# EAGLE design Adafruit MPR121Q QT Gator Breakout (EAGLE 9.6.2)
COMPANY: ADAFRUIT INDUSTRIES; DRAWN: KTOWN; REV: A
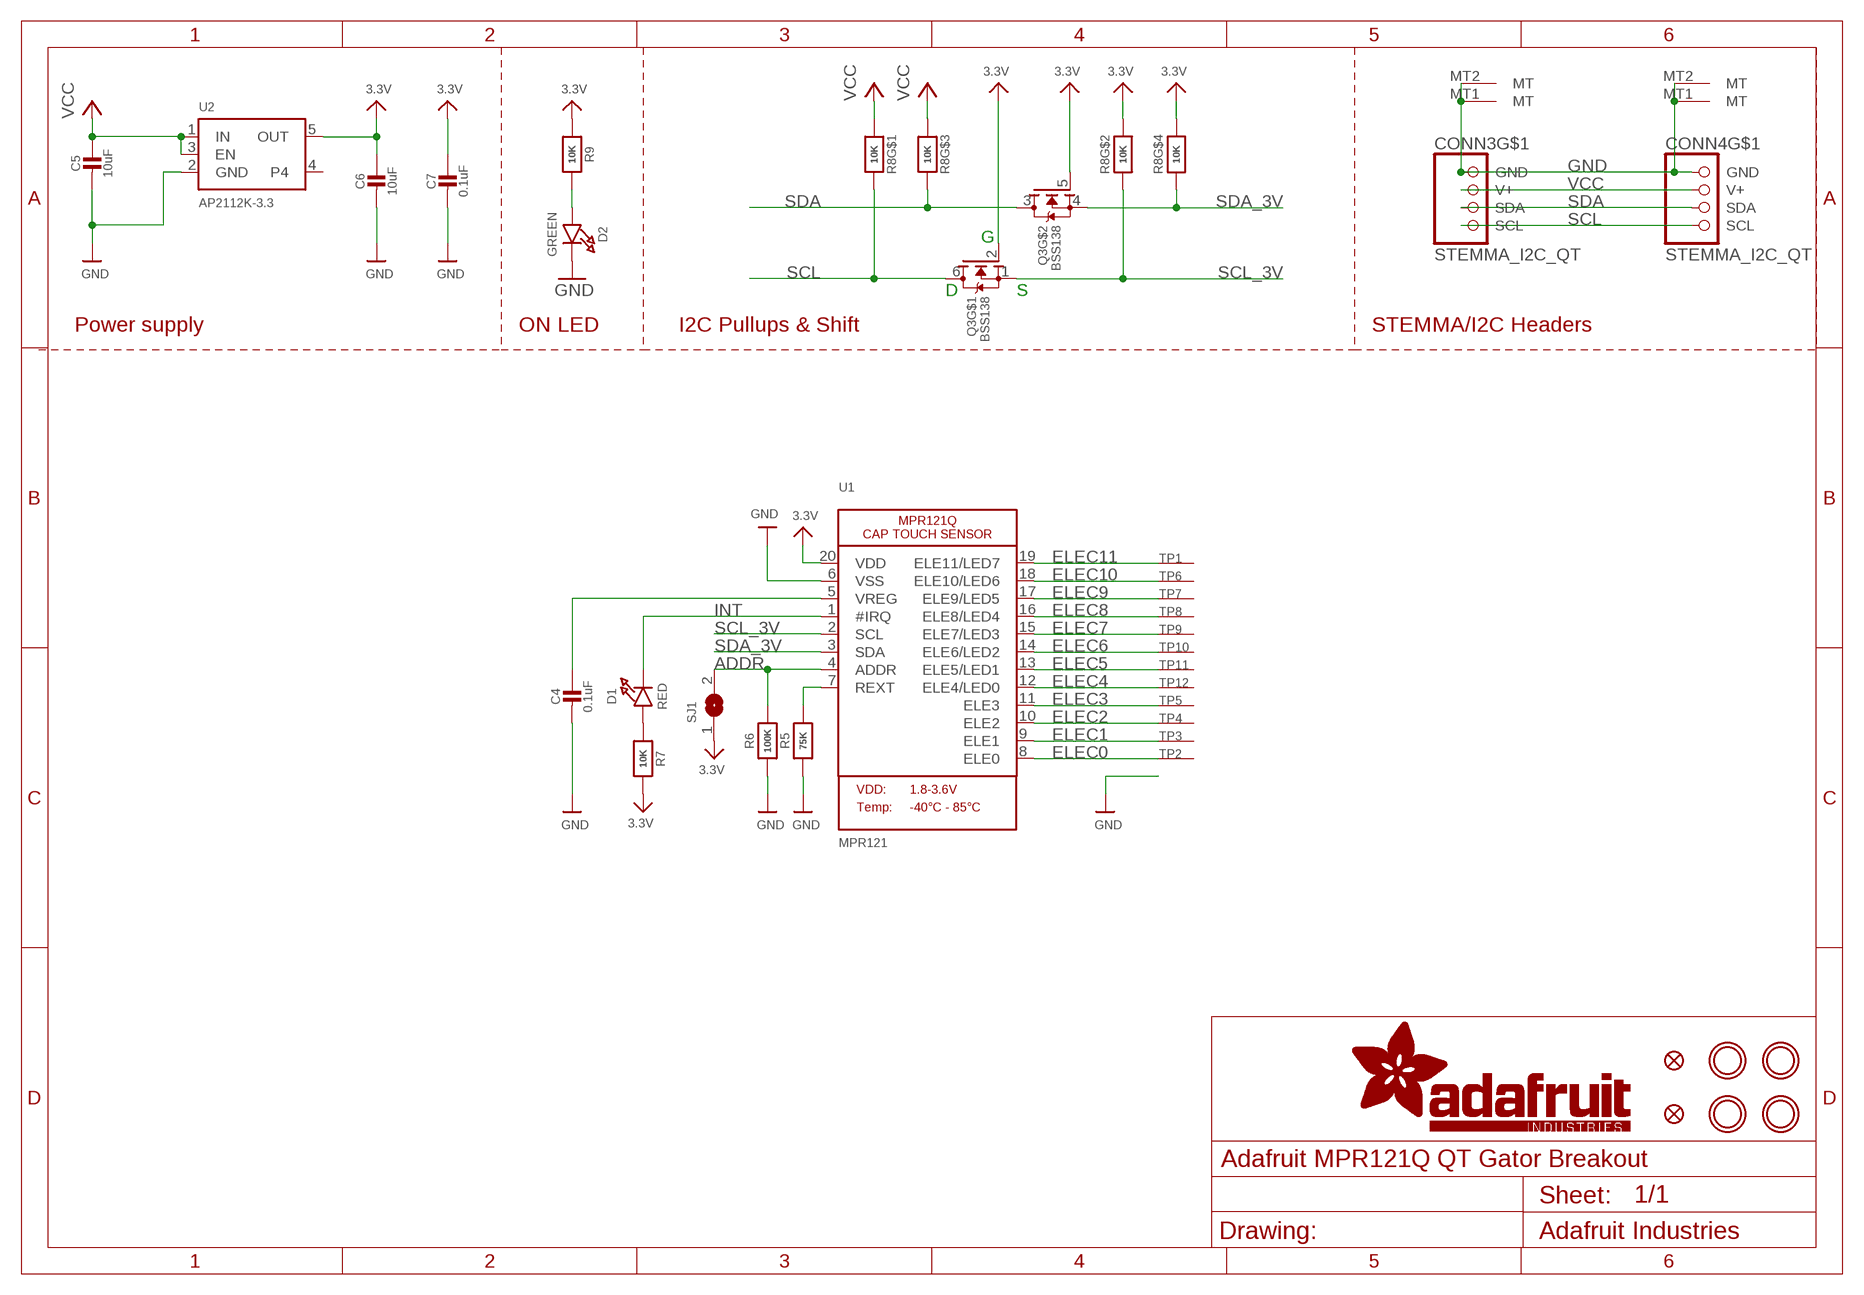
[diagram p0: schematic, sheet 1]

## Parts
C4  0.1uF  CAP_CERAMIC0603_NO  [0603-NO]
C5  10uF  CAP_CERAMIC0805-NOOUTLINE  [0805-NO]
C6  10uF  CAP_CERAMIC0805-NOOUTLINE  [0805-NO]
C7  0.1uF  CAP_CERAMIC0603_NO  [0603-NO]
CONN3  STEMMA_I2C_QT  [JST_SH4]
CONN4  STEMMA_I2C_QT  [JST_SH4]
D1  RED  LED0603_NOOUTLINE  [CHIPLED_0603_NOOUTLINE]
D2  GREEN  LED0603_NOOUTLINE  [CHIPLED_0603_NOOUTLINE]
FID3  FIDUCIAL_1MM  [FIDUCIAL_1MM]
FID4  FIDUCIAL_1MM  [FIDUCIAL_1MM]
Q3  BSS138  MOSFET-N_DUAL  [SOT363]
R5  75K  RESISTOR_0603_NOOUT  [0603-NO]
R6  100K  RESISTOR_0603_NOOUT  [0603-NO]
R7  10K  RESISTOR_0603_NOOUT  [0603-NO]
R8  10K  RESISTOR_4PACK  [RESPACK_4X0603]
R9  10K  RESISTOR_0603_NOOUT  [0603-NO]
SJ1  SOLDERJUMPER  [SOLDERJUMPER_ARROW_NOPASTE]
TP1  SEWTAPPCB_ALLIGATOR  [PCB_ALLI]
TP2  SEWTAPPCB_ALLIGATOR  [PCB_ALLI]
TP3  SEWTAPPCB_ALLIGATOR  [PCB_ALLI]
TP4  SEWTAPPCB_ALLIGATOR  [PCB_ALLI]
TP5  SEWTAPPCB_ALLIGATOR  [PCB_ALLI]
TP6  SEWTAPPCB_ALLIGATOR  [PCB_ALLI]
TP7  SEWTAPPCB_ALLIGATOR  [PCB_ALLI]
TP8  SEWTAPPCB_ALLIGATOR  [PCB_ALLI]
TP9  SEWTAPPCB_ALLIGATOR  [PCB_ALLI]
TP10  SEWTAPPCB_ALLIGATOR  [PCB_ALLI]
TP11  SEWTAPPCB_ALLIGATOR  [PCB_ALLI]
TP12  SEWTAPPCB_ALLIGATOR  [PCB_ALLI]
U1  MPR121  MPR121Q  [QFN20_3MM_NOTHERMAL]
U2  AP2112K-3.3  VREG_SOT23-5  [SOT23-5]
U$7  MOUNTINGHOLE2.5  [MOUNTINGHOLE_2.5_PLATED]
U$8  MOUNTINGHOLE2.5  [MOUNTINGHOLE_2.5_PLATED]
U$34  MOUNTINGHOLE2.5  [MOUNTINGHOLE_2.5_PLATED]
U$35  MOUNTINGHOLE2.5  [MOUNTINGHOLE_2.5_PLATED]

## Nets
3.3V: C6.1 C7.1 Q3.2(G) Q3.5(G) R7.2 R8.2 R8.4 R9.1 SJ1.1 U1.20(VDD) U2.5(OUT)
ADDR: R6.2 SJ1.2 U1.4(ADDR)
ELEC0: TP2.P$1(SEW) U1.8(ELE0)
ELEC1: TP3.P$1(SEW) U1.9(ELE1)
ELEC2: TP4.P$1(SEW) U1.10(ELE2)
ELEC3: TP5.P$1(SEW) U1.11(ELE3)
ELEC4: TP12.P$1(SEW) U1.12(ELE4/LED0)
ELEC5: TP11.P$1(SEW) U1.13(ELE5/LED1)
ELEC6: TP10.P$1(SEW) U1.14(ELE6/LED2)
ELEC7: TP9.P$1(SEW) U1.15(ELE7/LED3)
ELEC8: TP8.P$1(SEW) U1.16(ELE8/LED4)
ELEC9: TP7.P$1(SEW) U1.17(ELE9/LED5)
ELEC10: TP6.P$1(SEW) U1.18(ELE10/LED6)
ELEC11: TP1.P$1(SEW) U1.19(ELE11/LED7)
GND: C4.2 C5.2 C6.2 C7.2 CONN3.1(GND) CONN3.MT1(MT) CONN3.MT2(MT) CONN4.1(GND) CONN4.MT1(MT) CONN4.MT2(MT) D2.C R5.1 R6.1 U1.6(VSS) U2.2(GND)
INT: D1.C U1.1(#IRQ)
N$1: D1.A R7.1
N$2: C4.1 U1.5(VREG)
N$3: R5.2 U1.7(REXT)
N$4: D2.A R9.2
SCL: CONN3.4(SCL) CONN4.4(SCL) Q3.6(D) R8.8
SCL_3V: Q3.1(S) R8.7 U1.2(SCL)
SDA: CONN3.3(SDA) CONN4.3(SDA) Q3.3(D) R8.6
SDA_3V: Q3.4(S) R8.5 U1.3(SDA)
VCC [highpower]: C5.1 CONN3.2(V+) CONN4.2(V+) R8.1 R8.3 U2.1(IN) U2.3(EN)
Unconnected: U2.4

## Notes on the sheet
- G
- D | S
- Power supply | ON LED | I2C Pullups & Shift | STEMMA/I2C Headers

## Library data of the parts
C4-C7 = microbuilder:CAP_CERAMIC: Ceramic Capacitors For new designs, use the packages preceded by an '_' character since they are more reliable: The following footprints should be used on most boards: _0402 - Standard footprint for regular board layouts _0603 - Standard footprint for regular board layouts _0805 - Standard footprint for regular board layouts _1206 - Standard footprint for regular board layouts For extremely tight-pitch boards where space is at a premium, the following 'micro-pitch' footprints can be used (smaller pads, no silkscreen outline, etc.): _0402MP - Micro-pitch footprint for very dense/compact boards _0603MP - Micro-pitch footprint for very dense/compact boards _0805MP - Micro-pitch footprint for very dense/compact boards _1206MP - Micro-pitch footprint for very dense/compact boards
CONN3 CONN4 = microbuilder:STEMMA_I2C
D1 D2 = microbuilder:LED: LED 0603 - 0603 Surface Mount Package 2mA: Green LED - Low Power (3.9mcd, 2ma, 1.7Vf) - Digikey: 475-2709-2-ND Orange LED - Low Power (9.8mcd, 2ma, 1.8Vf) - Digikey: 475-1194-2-ND Red LED - Low Power (5mcd, 2ma, 1.8Vf) - Digikey: 475-1195-2-ND Yellow LED - Low Power (7mcd, 2ma, 1.8Vf) - Digikey: 475-1196-2-ND 5mA: Blue LED - Low Power (17mcd, 5ma, 2.9Vf) - Digikey: LNJ937W8CRACT-ND 0805 - 0805 Surface Mount Package 2mA: Red LED (8.8mcd, 2mA, 1.8Vf, Clear) - Low Power [Digikey: 475-2510-1-ND] Green LED (5mcd, 2mA, 1.8Vf, Clear) - Low Power [Digikey: 475-2730-1-ND] Yellow LED (11.3mcd, 2mA, 1.8Vf, Clear) - Low Power [Digikey: 475-2555-1-ND] 20mA: Red LED (104mcd, 20mA, Diffused) - LS R976 [Digikey: 475-1278-6-ND] Red LED (12mcd, 20mA, 2.0Vf, Clear) - APT2012EC [Digikey: 754-1128-1-ND] Green LED (15mcd, 20mA, 2.2Vf, Clear) - APT2012GC [Digikey: 754-1131-1-ND] Orange LED (160mcd, 20mA, 2.1Vf, Clear) - APT2012SECK [Digikey: 754-1130-1-ND] 1206 - 1206 Surface Mount Package Green LED (26mcd, 20mA, Diffused) - LG N971 [Digikey: 475-1407-6-ND] Red LED (15mcd, 20mA, Diffused) - LH N974 [Digikey: 475-1416-6-ND] Cree - Cree High-Power Surface Mount LEDs XPEBWT-L1-0000-00D50 - White 111lm 350mA 2.9Vf 6200K 110° XTEAWT-00-0000-00000LEE3 - White 114lm 350mA 2.85Vf 5000K 115° Everlight - Everlight 45-21 Series Surface Mount LEDs 45-21/QK2C-B2832AC2CB2/2T - Warm White 2000mcd 20mA 3.25Vf 3050K 120° 45-21/LK2C-B38452C4CB2/2T - Nuetral White 2000mcd 20mA 3.25Vf 4150K 120° 45-21/LK2C-B50634C6CB2/2T - Cold White 2200mcd 20mA 3.25Vf 5650K 120° PLCC2 Reverse Mount LS T77K-J1L2-1-0-2-R18-Z - Red 11.25mcd 2mA 1.8Vf 630nm 120° LO T77K-L1M2-24-Z - Orange 19.6mcd 2mA 1.8Vf 606nm 120° LY T77K-K2M1-26-Z - Yellow 15.7mcd 2mA 1.8Vf 587nm 120°
FID3 FID4 = microbuilder:FIDUCIAL: Fiducial Alignment Points Various fiducial points for machine vision alignment.; BOM: EXCLUDE
Q3 = microbuilder:MOSFET-N_DUAL: Dual N-Channel MOSFET SOT363 (2.0x1.25mm) 2N7002PS - 60V, 320mA [Digikey: 568-5984-1-ND]
R5 R6 R9 = microbuilder:RESISTOR: Resistors For new designs, use the packages preceded by an '_' character since they are more reliable: The following footprints should be used on most boards: _0402 - Standard footprint for regular board layouts _0603 - Standard footprint for regular board layouts _0805 - Standard footprint for regular board layouts _1206 - Standard footprint for regular board layouts For extremely tight-pitch boards where space is at a premium, the following 'micro-pitch' footprints can be used (smaller pads, no silkscreen outline, etc.): _0402MP - Micro-pitch footprint for very dense/compact boards _0603MP - Micro-pitch footprint for very dense/compact boards _0805MP - Micro-pitch footprint for very dense/compact boards _1206MP - Micro-pitch footprint for very dense/compact boards
R7 = microbuilder:RESISTOR: Resistors For new designs, use the packages preceded by an '_' character since they are more reliable: The following footprints should be used on most boards: _0402 - Standard footprint for regular board layouts _0603 - Standard footprint for regular board layouts _0805 - Standard footprint for regular board layouts _1206 - Standard footprint for regular board layouts For extremely tight-pitch boards where space is at a premium, the following 'micro-pitch' footprints can be used (smaller pads, no silkscreen outline, etc.): _0402MP - Micro-pitch footprint for very dense/compact boards _0603MP - Micro-pitch footprint for very dense/compact boards _0805MP - Micro-pitch footprint for very dense/compact boards _1206MP - Micro-pitch footprint for very dense/compact boards; REV: A
R8 = microbuilder:RESISTOR_4PACK: Resistor Packs (4 resistors) 4 x 0603 10K 1/16W - Digikey: YC164J-10KCT-ND
SJ1 = microbuilder:SOLDERJUMPER: SMD Solder JUMPER Solder the two pads together to create a connection, or remove the solder to break it. REFLOW - Use this footprint for solder paste and reflow ovens. WAVE - Use this footprint for hand-soldering (larger pads). CLOSED - Has a trace between the two pads to ensure it is closed by default. The trace needs to be cut to disable the jumper, and can be closed again by creating a solder bridge between the two pads.; BOM: EXCLUDE
TP1-TP12 = microbuilder:SEWTAP
U1 = microbuilder:MPR121Q: MPR121Q - 12 Electrode Cap Touch Sensor Can drive up to 8 LEDs
U2 = microbuilder:VREG_SOT23-5: SOT23-5 Fixed Voltage Regulators Part Current Out V Out V In V Dropout θJA (°C/W) TJ (°C) Digikey Part No. ADP121 150mA 3.3V 3.4-5.5V 0.09V @ 150mA -- -- ADP121-AUJZ33R7CT-ND ADP121 150mA 3.0V 3.1-5.5V 0.09V @ 150mA -- -- ADP121-AUJZ30R7CT-ND ADP122 300mA 3.3V 3.4-5.5V 0.085V @ 300mA -- -- ADP122AUJZ-3.3-R7CT-ND ADP1712 300mA 3.3V 3.5-5.5V 0.17V @ 300mA -- -- ADP1712AUJZ-3.3-R7TR-ND AP7311 (Low Cost) 150mA 3.3V 3.5-6V 0.15V @ 150mA -- -- AP7311-33WG-7DICT-ND LD39015M18R 150mA 1.8V 1.9V-5.5V 0.08V @ 100mA -- -- 497-6977-1-ND LP2985A-33DBVR 150mA 3.3V 3.3-16V 0.28V @ 150mA 206 150 296-18479-1-ND MCP1824T-3302E/OT 300mA 3.3V 3.5V-6V 0.2V @ 300mA -- -- MCP1824T-3302E/OTCT-ND MIC5205-2.5YM5 TR 150mA 2.5V 2.7-16V 0.165V @ 150mA -- -- 576-1257-2-ND MIC5205-3.0YM5 TR 150mA 3.0V 3.2V-16V 0.165V @ 150mA -- -- 576-1258-2-ND MIC5205-3.3YM5 TR 150mA 3.3V 3.5V-16V 0.165V @ 150mA -- -- 576-1259-2-ND TPS780330220 150mA 3.3V+2.2V 3.6-5.5V 250mV Max -- -- 296-23332-1-ND TDA3663/N1,135 100mA 3.3V 3.5-45V 0.18V @ 50mA -- -- 568-5343-1-ND Max operating temp can be calculated using θJA, TJ (max junction temperature), and power in watts. Set the "Maximum Ambient Temperature" until it reaches TJ ("Max Junction Temperature"), which is the absolute limit for safe use of the regulator: Heat Sink Temperature Calculator <http://www.daycounter.com/Calculators/Heat-Sink-Temperature-Calculator.phtml> For example, With 12V source into a 3.3V LP2985 and a 30mA load, we are dissipating (12V-3.3V) * 0.03A = 0.261W. With a θJA of 206 °C/W, a TJ of 150°C, and 261mW we can safely use the chip without a heat sink up to 75°C (=147.1°C Junction Temperature).
U$7 U$8 U$34 U$35 = microbuilder:MOUNTINGHOLE: Mounting Hole For #2 screws (0.086"/2.18mm width, 0.094"/2.4mm hole) use 2.5mm; BOM: EXCLUDE

## Net classes
1 highpower: width 0.305 mm, drill 0.483 mm
2 lowpower: width 0.254 mm, drill 0.483 mm

## Board
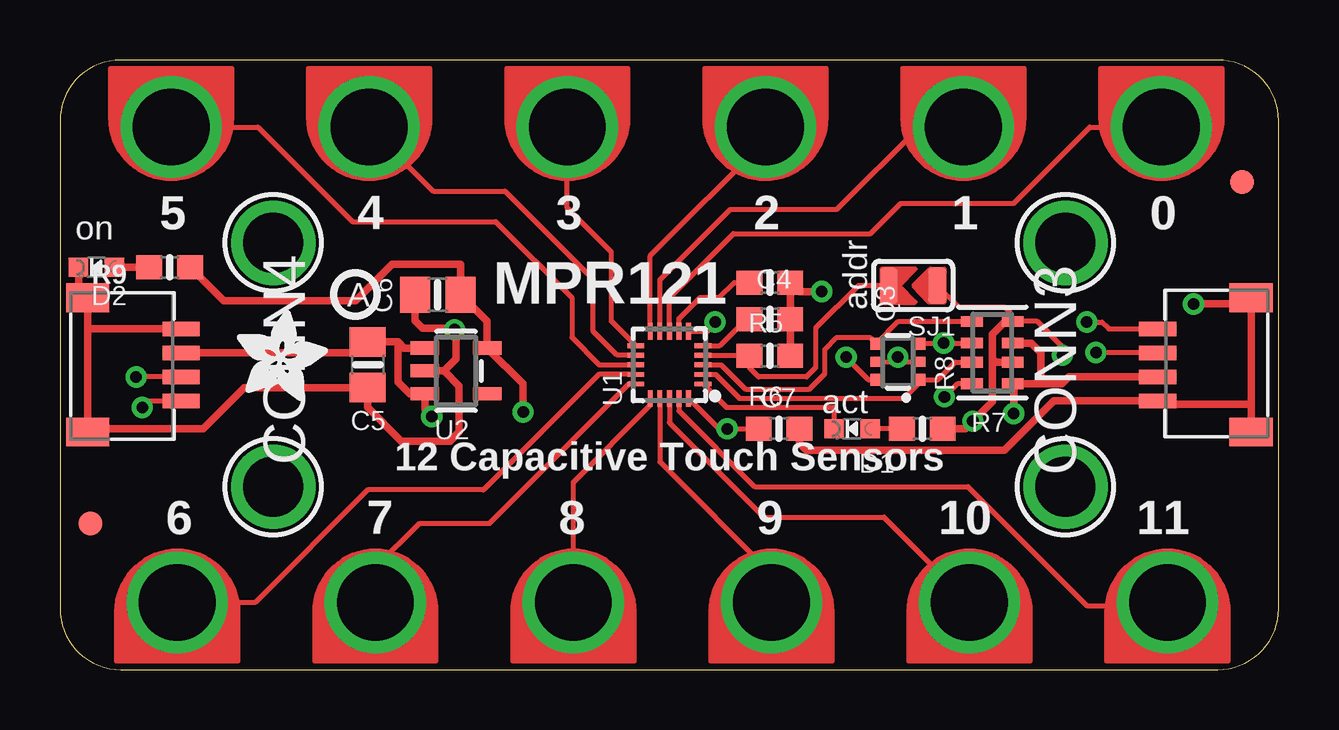
[diagram p1: board, top side]
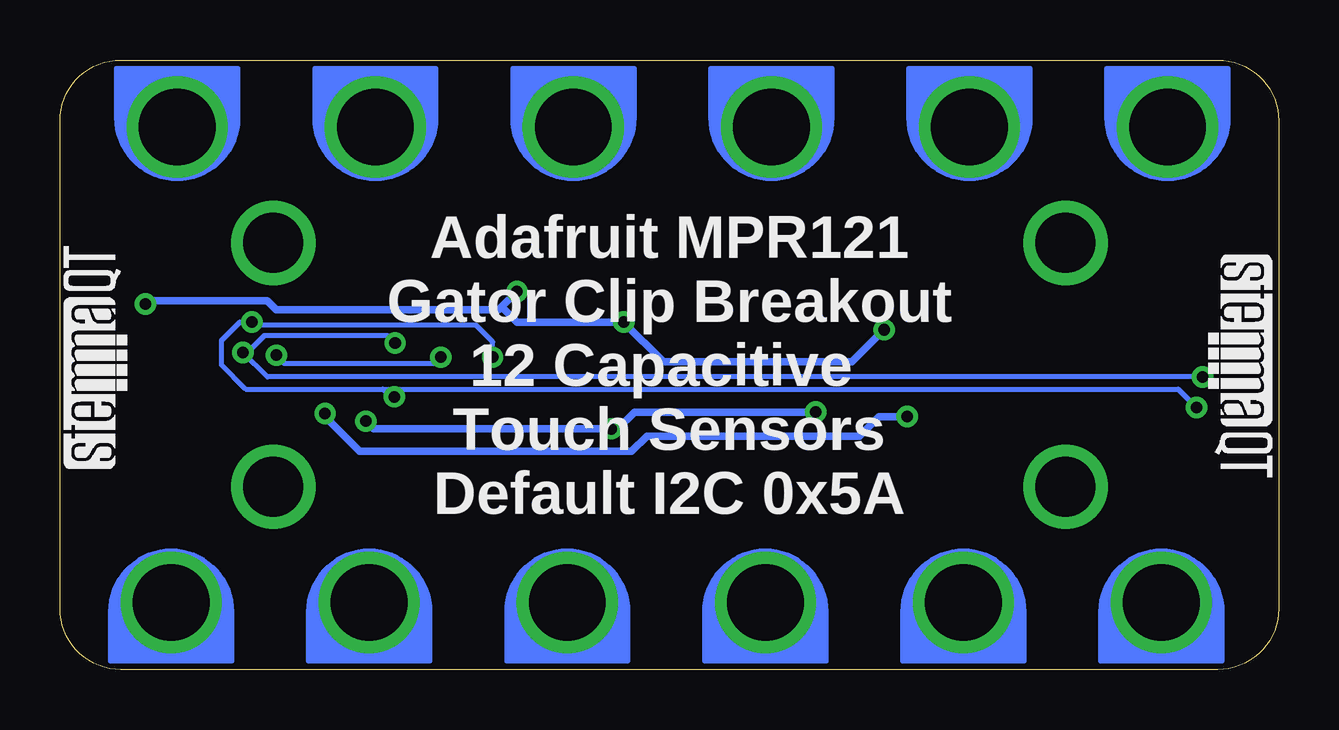
[diagram p2: board, bottom side, seen from below]

Size 50.8 x 25.4 mm. Coordinates in mm from the lower left corner, seen from the top.
Outline: 0,22.86 0,2.54 arc90 2.54,0 48.26,0 arc90 50.8,2.54 50.8,22.86 arc90 48.26,25.4 2.54,25.4 arc90 0,22.86
Copper layers (1*16): Top 0.035mm / dielectric 1.5mm / Bottom 0.035mm
Design rules "adafruit *": minimum track width 7mil, minimum drill 15.5mil, track to track 7mil, track to pad 7mil, pad to pad 7mil, via to via 7mil, smd to smd 6mil, copper to edge 10mil, drill to drill 8mil, minimum pad ring 10mil, minimum via ring 8mil, stop-mask expansion 2mil, vias tented up to drill 20mil, thermal gap 10mil

### Footprints (pad centres in the part's own frame; a part is rotated, then mirrored left to right if it is on the bottom)
0603-NO = smd 1.075 x 1: 1 -0.85,0; 2 0.85,0
0805-NO = smd 1.24 x 1.5: 1 -0.95,0; 2 0.95,0
JST_SH4 = smd 0.6 x 1.55: 1 -1.5,2.514; 2 -0.5,2.514; 3 0.5,2.514; 4 1.5,2.514 | smd 1.2 x 1.8: MT1 -2.8,-1.386; MT2 2.8,-1.386
CHIPLED_0603_NOOUTLINE = smd 0.8 x 0.8: A 0,-0.75; C 0,0.75
FIDUCIAL_1MM = smd 1 x 1: 1 0,0
SOT363 = smd 0.5 x 0.5: 1 -0.75,-0.9; 3 0.75,-0.9; 4 0.75,0.9; 6 -0.75,0.9 | smd 0.4 x 0.5: 2 0,-0.9; 5 0,0.9
RESPACK_4X0603 = smd 0.45 x 0.9: 1 -1.3,-0.85; 2 -0.4,-0.85; 3 0.4,-0.85; 4 1.3,-0.85; 5 1.3,0.85; 6 0.4,0.85; 7 -0.4,0.85; 8 -1.3,0.85
SOLDERJUMPER_ARROW_NOPASTE = smd 0.762 x 1.524: 1 -1.016,0; 2 1.016,0
PCB_ALLI = drill 3.2: P$1 0,0.508
QFN20_3MM_NOTHERMAL = smd 0.7 x 0.2: 1 -1.4,0.8; 2 -1.4,0.4; 3 -1.4,0; 4 -1.4,-0.4; 5 -1.4,-0.8; 11 1.4,-0.8; 12 1.4,-0.4; 13 1.4,0; 14 1.4,0.4; 15 1.4,0.8 | smd 0.2 x 0.7: 6 -0.8,-1.4; 7 -0.4,-1.4; 8 0,-1.4; 9 0.4,-1.4; 10 0.8,-1.4; 16 0.8,1.4; 17 0.4,1.4; 18 0,1.4; 19 -0.4,1.4; 20 -0.8,1.4
SOT23-5 = smd 0.55 x 1.2: 1 -0.95,-1.3; 2 0,-1.3; 3 0.95,-1.3; 4 0.95,1.3; 5 -0.95,1.3
MOUNTINGHOLE_2.5_PLATED = drill 2.5 pad 3.2: P$1 0,0

### Placement (x,y rotation side)
C4  29.59,14.61 0 top
C5  12.83,12.7 270 top
C6  15.75,15.62 180 top
C7  29.97,10.03 0 top
CONN3  48.26,12.7 90 top
CONN4  2.54,12.7 270 top
D1  33.02,10.03 90 top
D2  1.52,16.76 90 top
FID3  1.27,6.1 0 top
FID4  49.28,20.32 0 top
Q3  34.92,12.83 90 top
R5  29.59,16.13 180 top
R6  29.59,13.08 180 top
R7  35.94,10.03 0 top
R8  38.86,13.21 90 top
R9  4.57,16.76 180 top
SJ1  35.56,16 180 top
TP1  46.16,3.3 180 top
TP2  45.91,22.1 0 top
TP3  37.66,22.1 0 top
TP4  29.4,22.1 0 top
TP5  21.15,22.1 0 top
TP6  37.91,3.3 180 top
TP7  29.65,3.3 180 top
TP8  21.4,3.3 180 top
TP9  13.14,3.3 180 top
TP10  4.89,3.3 180 top
TP11  4.64,22.1 0 top
TP12  12.89,22.1 0 top
U1  25.4,12.7 180 top
U2  16.51,12.45 270 top
U$7  41.91,17.78 0 top
U$8  41.91,7.62 0 top
U$10  [PCBFEAT-REV-040]  12.32,15.62 0 top
U$34  8.89,17.78 0 top
U$35  8.89,7.62 0 top
U$37  [ADAFRUIT_3.5MM]  7.37,11.18 0 top
U$39  [STEMMAQT]  48.01,8.38 90 bottom
U$40  [STEMMAQT]  2.92,17.27 270 bottom

### Tracks (layer width: path | path; a pad name or v marks a point on that pad's centre or on a via)
3.3V  (via drill 0.48)
  Top 0.203: U1.20 27.47,10.03 27.69,10.03 | v27.81,10.03 C7.1 | Q3.5 34.8,12.83 | 34.8,12.83 Q3.2 | SJ1.1 37.47,15.11 39.37,15.11 39.62,14.86 39.62,14.51 | 34.8,12.83 34.92,12.95 v34.92,13.02 | v41.78,13.1 41.78,13.46 40.74,14.51 R8.4
  Top 0.305: R9.1 6.82,15.37 12.32,15.37 13.84,16.89 16.7,16.89 C6.1 17.81,14.51 U2.5 19.3,11.9 v19.3,10.73 | 27.69,10.03 v27.81,10.03 | R8.2 39.01,12.81 38.86,12.95 | 38.86,12.95 38.86,13.97 39.4,14.51 39.62,14.51 R8.4 | 38.86,12.95 38.86,11.16 v38.05,10.35 37.73,10.03 R7.2
  Bottom 0.203: v34.92,13.02 35.18,12.76 41.45,12.76 v41.78,13.1
  Bottom 0.305: v38.05,10.35 37.73,10.03 v27.81,10.03 27.56,10.03 26.86,10.73 v19.3,10.73
ADDR
  Top 0.203: U1.4 28.68,13.1 28.7,13.08 R6.2 28.74,12.57 29.12,12.19 31.11,12.19 31.5,12.57 31.5,14.22 33.27,16 SJ1.2
ELEC0
  Top 0.203: U1.8 25.4,15.49 28.07,18.16 33.78,18.16 35.05,19.43 39.75,19.43 42.93,22.61 TP2.P$1
ELEC1
  Top 0.203: U1.9 25,16.24 27.94,19.18 32.38,19.18 35.81,22.61 TP3.P$1
ELEC2
  Top 0.203: U1.10 24.6,17.23 29.4,22.04 TP4.P$1
ELEC3
  Top 0.203: U1.11 22.99,14.51 22.99,17.4 21.14,19.24 TP5.P$1
ELEC4
  Top 0.203: TP12.P$1 15.56,19.94 18.54,19.94 22.23,16.26 22.23,14.1 23.22,13.1 U1.12
ELEC5
  Top 0.203: TP11.P$1 8.26,22.61 12.19,18.67 18.16,18.67 21.34,15.49 21.34,13.84 22.48,12.7 U1.13
ELEC6
  Top 0.203: U1.14 22.46,12.3 17.65,7.49 12.83,7.49 8.13,2.79 TP10.P$1
ELEC7
  Top 0.203: TP9.P$1 13.14,4.25 14.99,6.1 17.91,6.1 23.71,11.9 U1.15
ELEC8
  Top 0.203: TP8.P$1 21.4,7.81 24.6,11.01 U1.16
ELEC9
  Top 0.203: U1.17 25,8.65 29.65,4 TP7.P$1
ELEC10
  Top 0.203: U1.18 25.4,10.29 29.34,6.35 34.35,6.35 TP6.P$1
ELEC11
  Top 0.203: U1.19 25.8,10.78 28.96,7.62 37.85,7.62 42.8,2.67 46.04,2.67 TP1.P$1
GND  (via drill 0.48)
  Top 0.203: U1.6 26.93,14.1
  Top 0.305: C6.2 14.8,14.54 15.11,14.22 16.38,14.22 v16.45,14.16 16.51,14.1 16.51,12.95 16,12.45 | 16,12.45 U2.2 | 16,12.45 16.64,11.81 16.64,9.91 16.26,9.53 14.22,9.53 12.83,10.92 C5.2 7.69,11.75 5.97,10.03 1.15,10.03 | 1.15,14.1 CONN4.MT1 0.77,15.88 D2.C | 1.15,14.1 1.15,10.03 | 1.15,10.03 CONN4.MT2 | CONN4.1 1.26,14.2 1.15,14.1 | R6.1 C4.2 R5.1 30.82,15.75 v31.75,15.75 | C7.2 30.82,9.44 31.11,9.14 39.37,9.14 41.43,11.2 CONN3.1 45.9,11.05 49.65,11.05 | CONN3.MT2 49.65,15.24 | 49.65,15.24 49.65,11.05 | 49.65,11.05 CONN3.MT1 | v47.24,15.24 49.65,15.24 | 26.93,14.1 v27.3,14.48
  Bottom 0.305: v31.75,15.75 32.38,15.11 | 32.38,15.11 32.51,14.99 41.78,14.99 42.16,15.37 47.12,15.37 v47.24,15.24 | 32.38,15.11 31.75,14.48 v27.3,14.48 25.65,12.83 17.78,12.83 v16.45,14.16
INT
  Top 0.203: U1.1 27.78,10.92 32.27,10.92 D1.C
N$1
  Top 0.203: R7.1 D1.A
N$2
  Top 0.203: U1.5 27.51,13.5 28.61,14.61 C4.1
N$3
  Top 0.203: U1.7 25.8,14.62 26.67,15.49 27.47,15.49 28.11,16.13 R5.2
N$4
  Top 0.305: D2.A R9.2
SCL  (via drill 0.48)
  Top 0.203: v3.43,10.92 3.71,11.2 CONN4.4 | Q3.6 33.71,12.08 v32.77,13.02 | v42.8,14.48 43.44,14.48 43.71,14.2 CONN3.4 | R8.8 37.41,11.91 v36.87,11.37
  Bottom 0.203: v3.43,10.92 4.19,11.68 37.34,11.68 | 37.34,11.68 43.05,11.68 44.07,12.7 44.07,13.72 43.31,14.48 v42.8,14.48 42.67,14.35 33.47,14.35 32.77,13.65 v32.77,13.02 | v36.87,11.37 37.02,11.37 37.34,11.68
SCL_3V
  Top 0.203: U1.2 27.32,12.3 28.32,11.3 35.18,11.3 35.83,11.95 Q3.1 36.59,12.08 37.27,12.76 37.32,12.81 | 37.32,12.81 | 37.32,12.81 R8.7
SDA  (via drill 0.48)
  Top 0.203: CONN4.3 3.18,12.2 v3.17,12.19 | CONN3.3 v43.19,13.2 v43.18,13.21 | Q3.3 35.86,13.61 v36.83,13.61 R8.6
  Bottom 0.203: v3.17,12.19 42.16,12.19 v43.18,13.21 42.99,13.21 42.27,13.93 37.15,13.93 v36.83,13.61
SDA_3V
  Top 0.203: U1.3 27.56,12.7 28.57,11.68 31.24,11.68 31.88,12.32 31.88,13.34 32.37,13.83 33.77,13.83 Q3.4 34.95,14.51 R8.5
VCC  (via drill 0.48)
  Top 0.305: CONN4.2 12.38,13.2 C5.1 14.1,13.65 | 14.1,13.65 14.1,11.97 14.57,11.5 U2.3 15.21,10.82 v15.49,10.54 | CONN3.2 42.05,12.2 41.75,11.91 40.89,11.91 | 40.89,11.91 R8.1 39.75,11.87 v39.75,10.67 | R8.3 40.49,13.61 40.89,13.21 40.89,11.91 | U2.1 14.35,13.4 14.1,13.65
  Bottom 0.305: v15.49,10.54 16.66,10.54 17.47,9.73 26.34,9.73 26.98,9.09 38.3,9.09 39.75,10.54 v39.75,10.67

### Text on the board
tPlace: 5 | 4 | 3 | 2 | 1 | 0 | on | addr | MPR121 | act | 12 Capacitive Touch Sensors | 6 | 7 | 8 | 9 | 10 | 11
bPlace: Adafruit MPR121 / Gator Clip Breakout / 12 Capacitive / Touch Sensors / Default I2C 0x5A